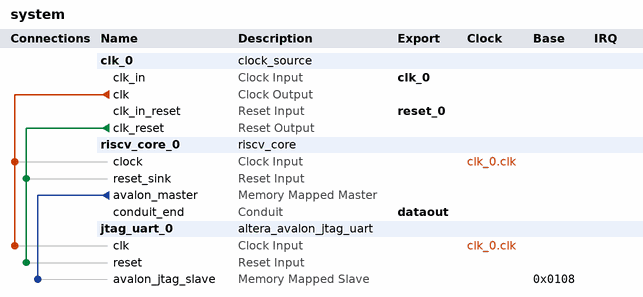
[diagram p0: system contents]
# Platform Designer (Qsys) system system, Cyclone II EP2C20F484C7
# Parameters at their usual value, and those the tool derives, are not listed.
package require -exact qsys 13.0
create_system system
set_project_property DEVICE_FAMILY {Cyclone II}
set_project_property DEVICE EP2C20F484C7

add_instance clk_0 clock_source 13.0
set_instance_parameter_value clk_0 clockFrequency 24000000

add_instance riscv_core_0 riscv_core 1.0

add_instance jtag_uart_0 altera_avalon_jtag_uart 13.0.1.99.2
set_instance_parameter_value jtag_uart_0 simInteractiveOptions NO_INTERACTIVE_WINDOWS

# connections
add_connection clk_0.clk jtag_uart_0.clk clock
add_connection clk_0.clk riscv_core_0.clock clock
add_connection clk_0.clk_reset jtag_uart_0.reset reset
add_connection clk_0.clk_reset riscv_core_0.reset_sink reset
add_connection riscv_core_0.avalon_master jtag_uart_0.avalon_jtag_slave avalon
set_connection_parameter_value riscv_core_0.avalon_master/jtag_uart_0.avalon_jtag_slave baseAddress 0x0108

# exported interfaces
add_interface dataout conduit end
set_interface_property dataout EXPORT_OF riscv_core_0.conduit_end
add_interface clk_0 clock sink
set_interface_property clk_0 EXPORT_OF clk_0.clk_in
add_interface reset_0 reset sink
set_interface_property reset_0 EXPORT_OF clk_0.clk_in_reset

set_interconnect_requirement {$system} qsys_mm.clockCrossingAdapter HANDSHAKE
set_interconnect_requirement {$system} qsys_mm.maxAdditionalLatency 1

save_system system.qsys
